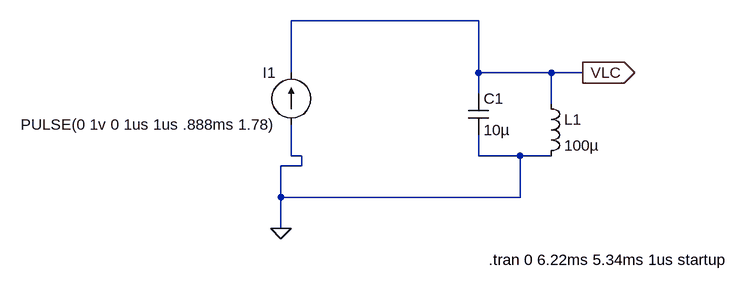
[diagram p0: schematic lc parallel cuircut.asc]
lc parallel cuircut.asc, the LTspice schematic file:
Version 4
SHEET 1 880 680
WIRE 384 128 96 128
WIRE 96 208 96 128
WIRE 384 208 384 128
WIRE 496 208 384 208
WIRE 544 208 496 208
WIRE 384 240 384 208
WIRE 496 256 496 208
WIRE 96 336 96 288
WIRE 112 336 96 336
WIRE 384 336 384 304
WIRE 448 336 384 336
WIRE 496 336 448 336
WIRE 112 352 112 336
WIRE 112 352 80 352
WIRE 80 400 80 352
WIRE 448 400 448 336
WIRE 448 400 80 400
WIRE 80 448 80 400
FLAG 80 448 0
FLAG 544 208 VLC
IOPIN 544 208 Out
SYMBOL current 96 288 R180
WINDOW 0 24 80 Left 2
WINDOW 3 24 0 Left 2
SYMATTR InstName I1
SYMATTR Value PULSE(0 1v 0 1us 1us .888ms 1.78)
SYMBOL ind 480 240 R0
SYMATTR InstName L1
SYMATTR Value 100µ
SYMATTR SpiceLine Ipk=1 Rser=85m Rpar=infin. Cpar=0 mfg="Coiltronics" pn="CTX100-1-52"
SYMBOL cap 368 240 R0
SYMATTR InstName C1
SYMATTR Value 10µ
TEXT 400 496 Left 2 !.tran 0 6.22ms 5.34ms 1us startup

The netlist it stands for:
* lc parallel cuircut.asc
I1 0 VLC PULSE(0 1v 0 1us 1us .888ms 1.78)
L1 VLC 0 100µ Ipk=1 Rser=85m Rpar=infin. Cpar=0 mfg="Coiltronics" pn="CTX100-1-52"
C1 VLC 0 10µ
.tran 0 6.22ms 5.34ms 1us startup
.backanno
.end